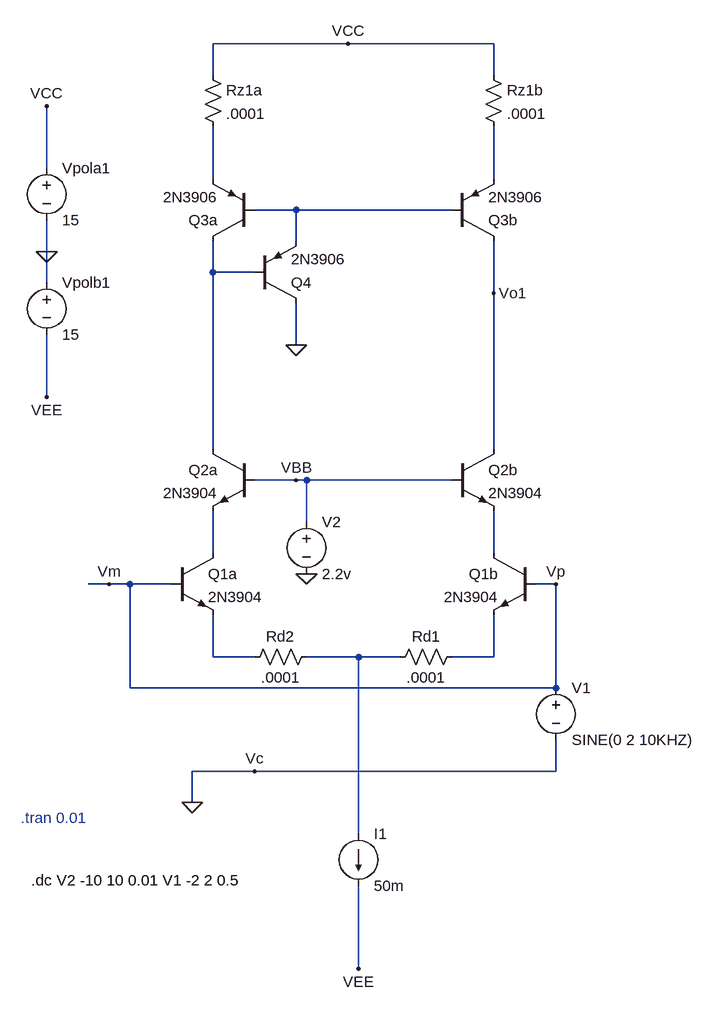
[diagram p0: schematic etage_premiere.asc]
etage_premiere.asc, the LTspice schematic file:
Version 4.1
SHEET 1 1056 1016
WIRE 512 -512 304 -512
WIRE 736 -512 512 -512
WIRE 304 -464 304 -512
WIRE 736 -464 736 -512
WIRE 48 -320 48 -416
WIRE 304 -304 304 -384
WIRE 736 -304 736 -384
WIRE 432 -256 368 -256
WIRE 672 -256 432 -256
WIRE 432 -208 432 -256
WIRE 48 -192 48 -240
WIRE 304 -160 304 -208
WIRE 368 -160 304 -160
WIRE 48 -144 48 -192
WIRE 736 -128 736 -208
WIRE 432 -48 432 -112
WIRE 48 32 48 -64
WIRE 304 112 304 -160
WIRE 736 112 736 -128
WIRE 432 160 368 160
WIRE 448 160 432 160
WIRE 672 160 448 160
WIRE 448 224 448 160
WIRE 304 272 304 208
WIRE 736 272 736 208
WIRE 144 320 112 320
WIRE 176 320 144 320
WIRE 240 320 176 320
WIRE 832 320 800 320
WIRE 304 432 304 368
WIRE 368 432 304 432
WIRE 528 432 448 432
WIRE 592 432 528 432
WIRE 736 432 736 368
WIRE 736 432 672 432
WIRE 176 480 176 320
WIRE 832 480 832 320
WIRE 832 480 176 480
WIRE 368 608 272 608
WIRE 832 608 832 560
WIRE 832 608 368 608
WIRE 272 656 272 608
WIRE 528 704 528 432
WIRE 528 912 528 784
FLAG 512 -512 VCC
FLAG 48 -416 VCC
FLAG 48 32 VEE
FLAG 48 -192 0
FLAG 432 160 VBB
FLAG 736 -128 Vo1
FLAG 832 320 Vp
FLAG 144 320 Vm
FLAG 432 -48 0
FLAG 368 608 Vc
FLAG 272 656 0
FLAG 528 912 VEE
FLAG 448 304 0
SYMBOL npn 240 272 R0
SYMATTR InstName Q1a
SYMATTR Value 2N3904
SYMBOL npn 800 272 M0
SYMATTR InstName Q1b
SYMATTR Value 2N3904
SYMBOL npn 672 112 R0
SYMATTR InstName Q2b
SYMATTR Value 2N3904
SYMBOL npn 368 112 M0
SYMATTR InstName Q2a
SYMATTR Value 2N3904
SYMBOL pnp 368 -208 R180
SYMATTR InstName Q3a
SYMATTR Value 2N3906
SYMBOL pnp 368 -112 M180
SYMATTR InstName Q4
SYMATTR Value 2N3906
SYMBOL pnp 672 -208 M180
SYMATTR InstName Q3b
SYMATTR Value 2N3906
SYMBOL res 288 -480 R0
SYMATTR InstName Rz1a
SYMATTR Value .0001
SYMBOL res 720 -480 R0
SYMATTR InstName Rz1b
SYMATTR Value .0001
SYMBOL voltage 48 -336 R0
WINDOW 123 0 0 Left 0
WINDOW 39 0 0 Left 0
SYMATTR InstName Vpola1
SYMATTR Value 15
SYMBOL voltage 48 -160 R0
WINDOW 123 0 0 Left 0
WINDOW 39 0 0 Left 0
SYMATTR InstName Vpolb1
SYMATTR Value 15
SYMBOL res 688 416 R90
WINDOW 0 0 56 VBottom 2
WINDOW 3 32 56 VTop 2
SYMATTR InstName Rd1
SYMATTR Value .0001
SYMBOL res 464 416 R90
WINDOW 0 0 56 VBottom 2
WINDOW 3 32 56 VTop 2
SYMATTR InstName Rd2
SYMATTR Value .0001
SYMBOL current 528 704 R0
WINDOW 123 0 0 Left 0
WINDOW 39 0 0 Left 0
SYMATTR InstName I1
SYMATTR Value 50m
SYMBOL voltage 448 208 R0
WINDOW 123 0 0 Left 0
WINDOW 39 0 0 Left 0
SYMATTR InstName V2
SYMATTR Value 2.2v
SYMBOL voltage 832 464 R0
WINDOW 123 0 0 Left 0
WINDOW 39 0 0 Left 0
SYMATTR InstName V1
SYMATTR Value SINE(0 2 10KHZ)
TEXT 8 680 Left 2 ;.tran 0.01
TEXT 24 776 Left 2 !.dc V2 -10 10 0.01 V1 -2 2 0.5

The netlist it stands for:
* etage_premiere.asc
Q1a N005 Vm N007 0 2N3904
Q1b N006 Vm N009 0 2N3904
Q2b Vo1 VBB N006 0 2N3904
Q2a N004 VBB N005 0 2N3904
Q3a N004 N003 N001 0 2N3906
Q4 0 N004 N003 0 2N3906
Q3b Vo1 N003 N002 0 2N3906
Rz1a VCC N001 .0001
Rz1b VCC N002 .0001
Vpola1 VCC 0 15
Vpolb1 0 VEE 15
Rd1 N009 N008 .0001
Rd2 N008 N007 .0001
I1 N008 VEE 50m
V2 VBB 0 2.2v
V1 Vm 0 SINE(0 2 10KHZ)
.model NPN NPN
.model PNP PNP
.lib standard.bjt
* .tran 0.01
.dc V2 -10 10 0.01 V1 -2 2 0.5
.backanno
.end